# Altium project manipulator1.PrjPcb
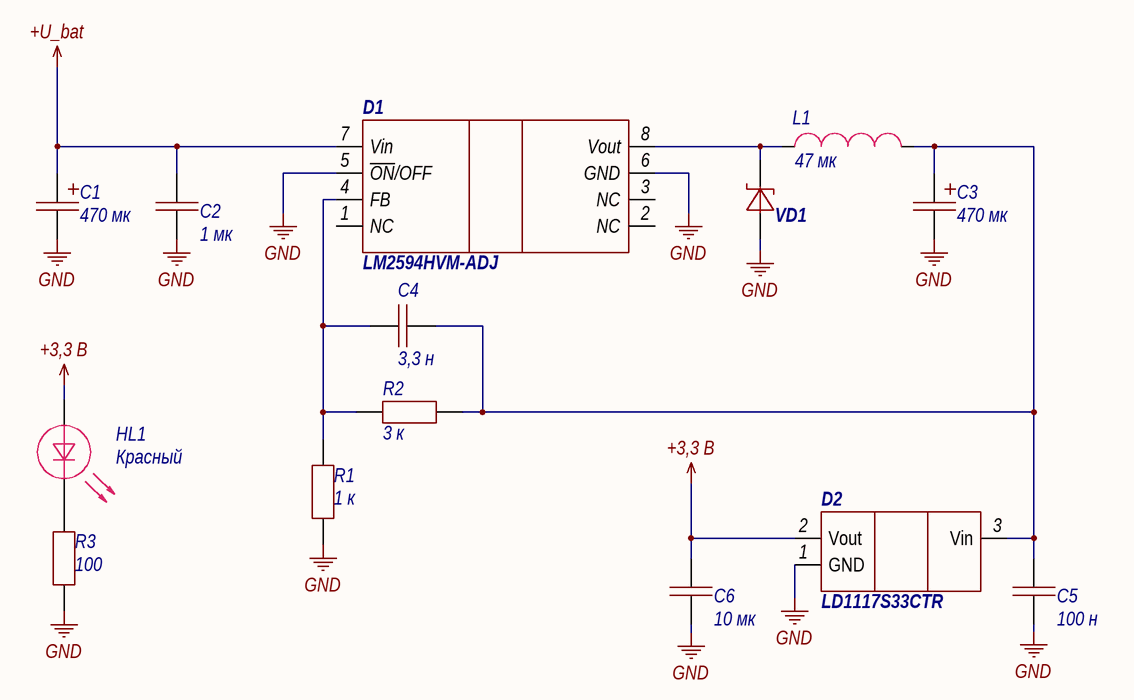
[diagram p0: Power 3.3V to mc.SchDoc]
3 sheets, 44 parts. Net scope: flat (ports and power ports of the same name join across sheets).
Board files: PCBtest.PcbDoc, PCBtest2.PcbDoc
Sheets:
  Power 3.3V to mc.SchDoc
  Power 12V to servo.SchDoc
  MC_stm32.SchDoc

## Sheet Power 3.3V to mc.SchDoc
size A4; SheetNumber: 1; SheetTotal: 3

### Parts
C1  value 470 мк  [RADIAL-2 8mm]  (hidden comment: Конденсатор полевой)
C2  value 1 мк  [0603C]  (hidden comment: Конденсатор)
C3  value 470 мк  [RADIAL-2 10MM]  (hidden comment: Конденсатор полевой)
C4  value 3,3 н  [0603C]  (hidden comment: Конденсатор)
C5  value 100 н  [0603C]  (hidden comment: Конденсатор)
C6  value 10 мк  [0603C]  (hidden comment: Конденсатор)
D1  LM2594HVM-ADJ  [SOIC_8N]
D2  LD1117S33CTR  [SOT223]
HL1  Color: Красный  [0805D]
L1  value 47 мк  [IND_B82477G]  (hidden comment: Inductance)
R1  value 1 к  [0603R]  (hidden comment: Resistor)
R2  value 3 к  [0603R]  (hidden comment: Resistor)
R3  value 100  [0603R]  (hidden comment: Resistor)
VD1  Диод Шоттки  [SMC]  (value not drawn)

### Nets
+3,3 В: C6.2 D2.2(Vout) HL1.1
+U_bat: C1.1 C2.2 D1.7(Vin)
GND: C1.2 C2.1 C3.2 C5.1 C6.1 D1.5(~{ON}/OFF) D1.6(GND) D2.1(GND) R1.2 R3.1 VD1.1
NetC3_1: C3.1 C4.2 C5.2 D2.3(Vin) L1.2 R2.2
NetC4_1: C4.1 D1.4(FB) R1.1 R2.1
NetD1_8: D1.8(Vout) L1.1 VD1.2
NetHL1_2: HL1.2 R3.2

Not connected (* = marked no-connect by the designer): D1 1(NC) 2(NC) 3(NC)

### Library data of the parts
C1 = Capacitor_pol: Конденсатор электролит. 470 мкФ, 50 В, 8 мм
C2 = Capacitor: Конденсатор керамический SMD, 0603, 1 мкФ
C3 = Capacitor_pol: Конденсатор электролит. 35В, 470мкФ, 10x16
C4 = Capacitor: Конденсатор керамический SMD, 0603
C5 = Capacitor: Конденсатор керамический SMD, 0603, 0.1 uF
C6 = Capacitor: Конденсатор керамический smd 10 мкФ, 0603,
D1 = LM2594HVM-ADJ: Импульсный DC-DC преобразователь, вход до 60 вольт, регулируемый выход, выходной ток 2 Ампера
D2 = LD1117S33CTR: Линейный стабилизатор напряжения 3,3 вольта. Максимальный ток - 0,8 ампер, гарантированное падение напряжения 1,3 вольта
HL1 = LED: Светодиод SMD 0805, 30 мА, 2.1 В; Manufacturer: -; Rate: -; Datasheet: -; Shop: -; Notice: -; Case: -
L1 = Inductance: Катушка индуктивности SMD, 47 мкГн, 2.5 А, 12.8х12.8, B82477G4473M,
R1 = Resistor: 0.1Вт 0603 1 кОм, 1%. Чип резистор (SMD); Power: *
R2 = Resistor: 0.1Вт 0603 1 кОм, 1%, Чип резистор (SMD); Power: *
R3 = Resistor: Резистор SMD, 43 Ом; Power: *
VD1 = Schottky diode: Диод Шоттки 30 В 3 А, SMD, SMC, SK33; Value: {Номинал}

## Sheet Power 12V to servo.SchDoc
size A4; SheetNumber: 2; SheetTotal: 3
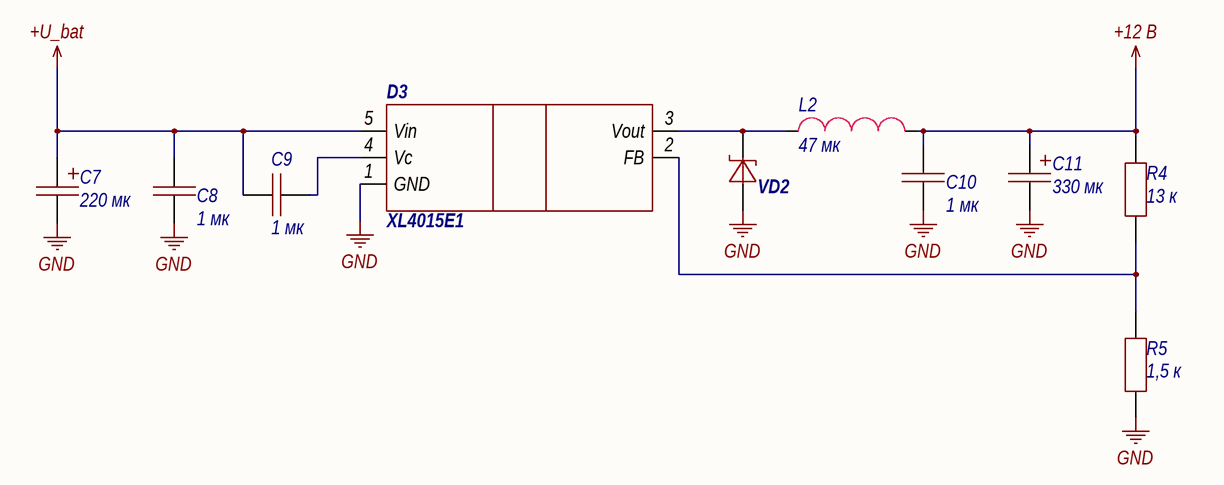
[diagram p1: Power 12V to servo.SchDoc]

### Parts
C7  value 220 мк  [RADIAL-2 10MM]  (hidden comment: Конденсатор полевой)
C8  value 1 мк  [0603C]  (hidden comment: Конденсатор)
C9  value 1 мк  [0603C]  (hidden comment: Конденсатор)
C10  value 1 мк  [0603C]  (hidden comment: Конденсатор)
C11  value 330 мк  [RADIAL-2 10MM]  (hidden comment: Конденсатор полевой)
D3  XL4015E1  [TO-263-5]
L2  value 47 мк  [IHLP-6767]  (hidden comment: Inductance)
R4  value 13 к  [0603R]  (hidden comment: Resistor)
R5  value 1,5 к  [0603R]  (hidden comment: Resistor)
VD2  Диод Шоттки  [SMC]  (value not drawn)

### Nets
+12 В: C10.1 C11.1 L2.2 R4.2
+U_bat: C7.1 C8.2 C9.2 D3.5(Vin)
GND: C7.2 C8.1 C10.2 C11.2 D3.1(GND) R5.1 VD2.1
NetC9_1: C9.1 D3.4(Vc)
NetD3_2: D3.2(FB) R4.1 R5.2
NetD3_3: D3.3(Vout) L2.1 VD2.2

### Library data of the parts
C7 = Capacitor_pol: Конденсатор электролит. 220 мкФ, 50 В, 10мм
C8-C10 = Capacitor: Конденсатор керамический SMD, 1 мкФ, 0603
C11 = Capacitor_pol: Конденсатор электролит. 330 мкФ, 25 В, 10 мм
D3 = XL4015E1: Импульсный DC-DC преобразователь. Вход до 36 В. Регулируемый выход. Выходной ток до 5А.
L2 = Inductance: Индуктивность экранированная 47 мкГн, 20%, 8.7 А, 42.7 мОм, IHLP6767GZER470M11
R4 = Resistor: Резистор SMD, 0603, 13 кОм; Power: *
R5 = Resistor: Резистор SMD 0603, 1.5 кОм; Power: *
VD2 = Schottky diode: Диод Шоттки 40 В, 5 А, SMC, B540C-13-F; Value: {Номинал}

## Sheet MC_stm32.SchDoc
size 420 x 297 mm; SheetNumber: 3; SheetTotal: 3
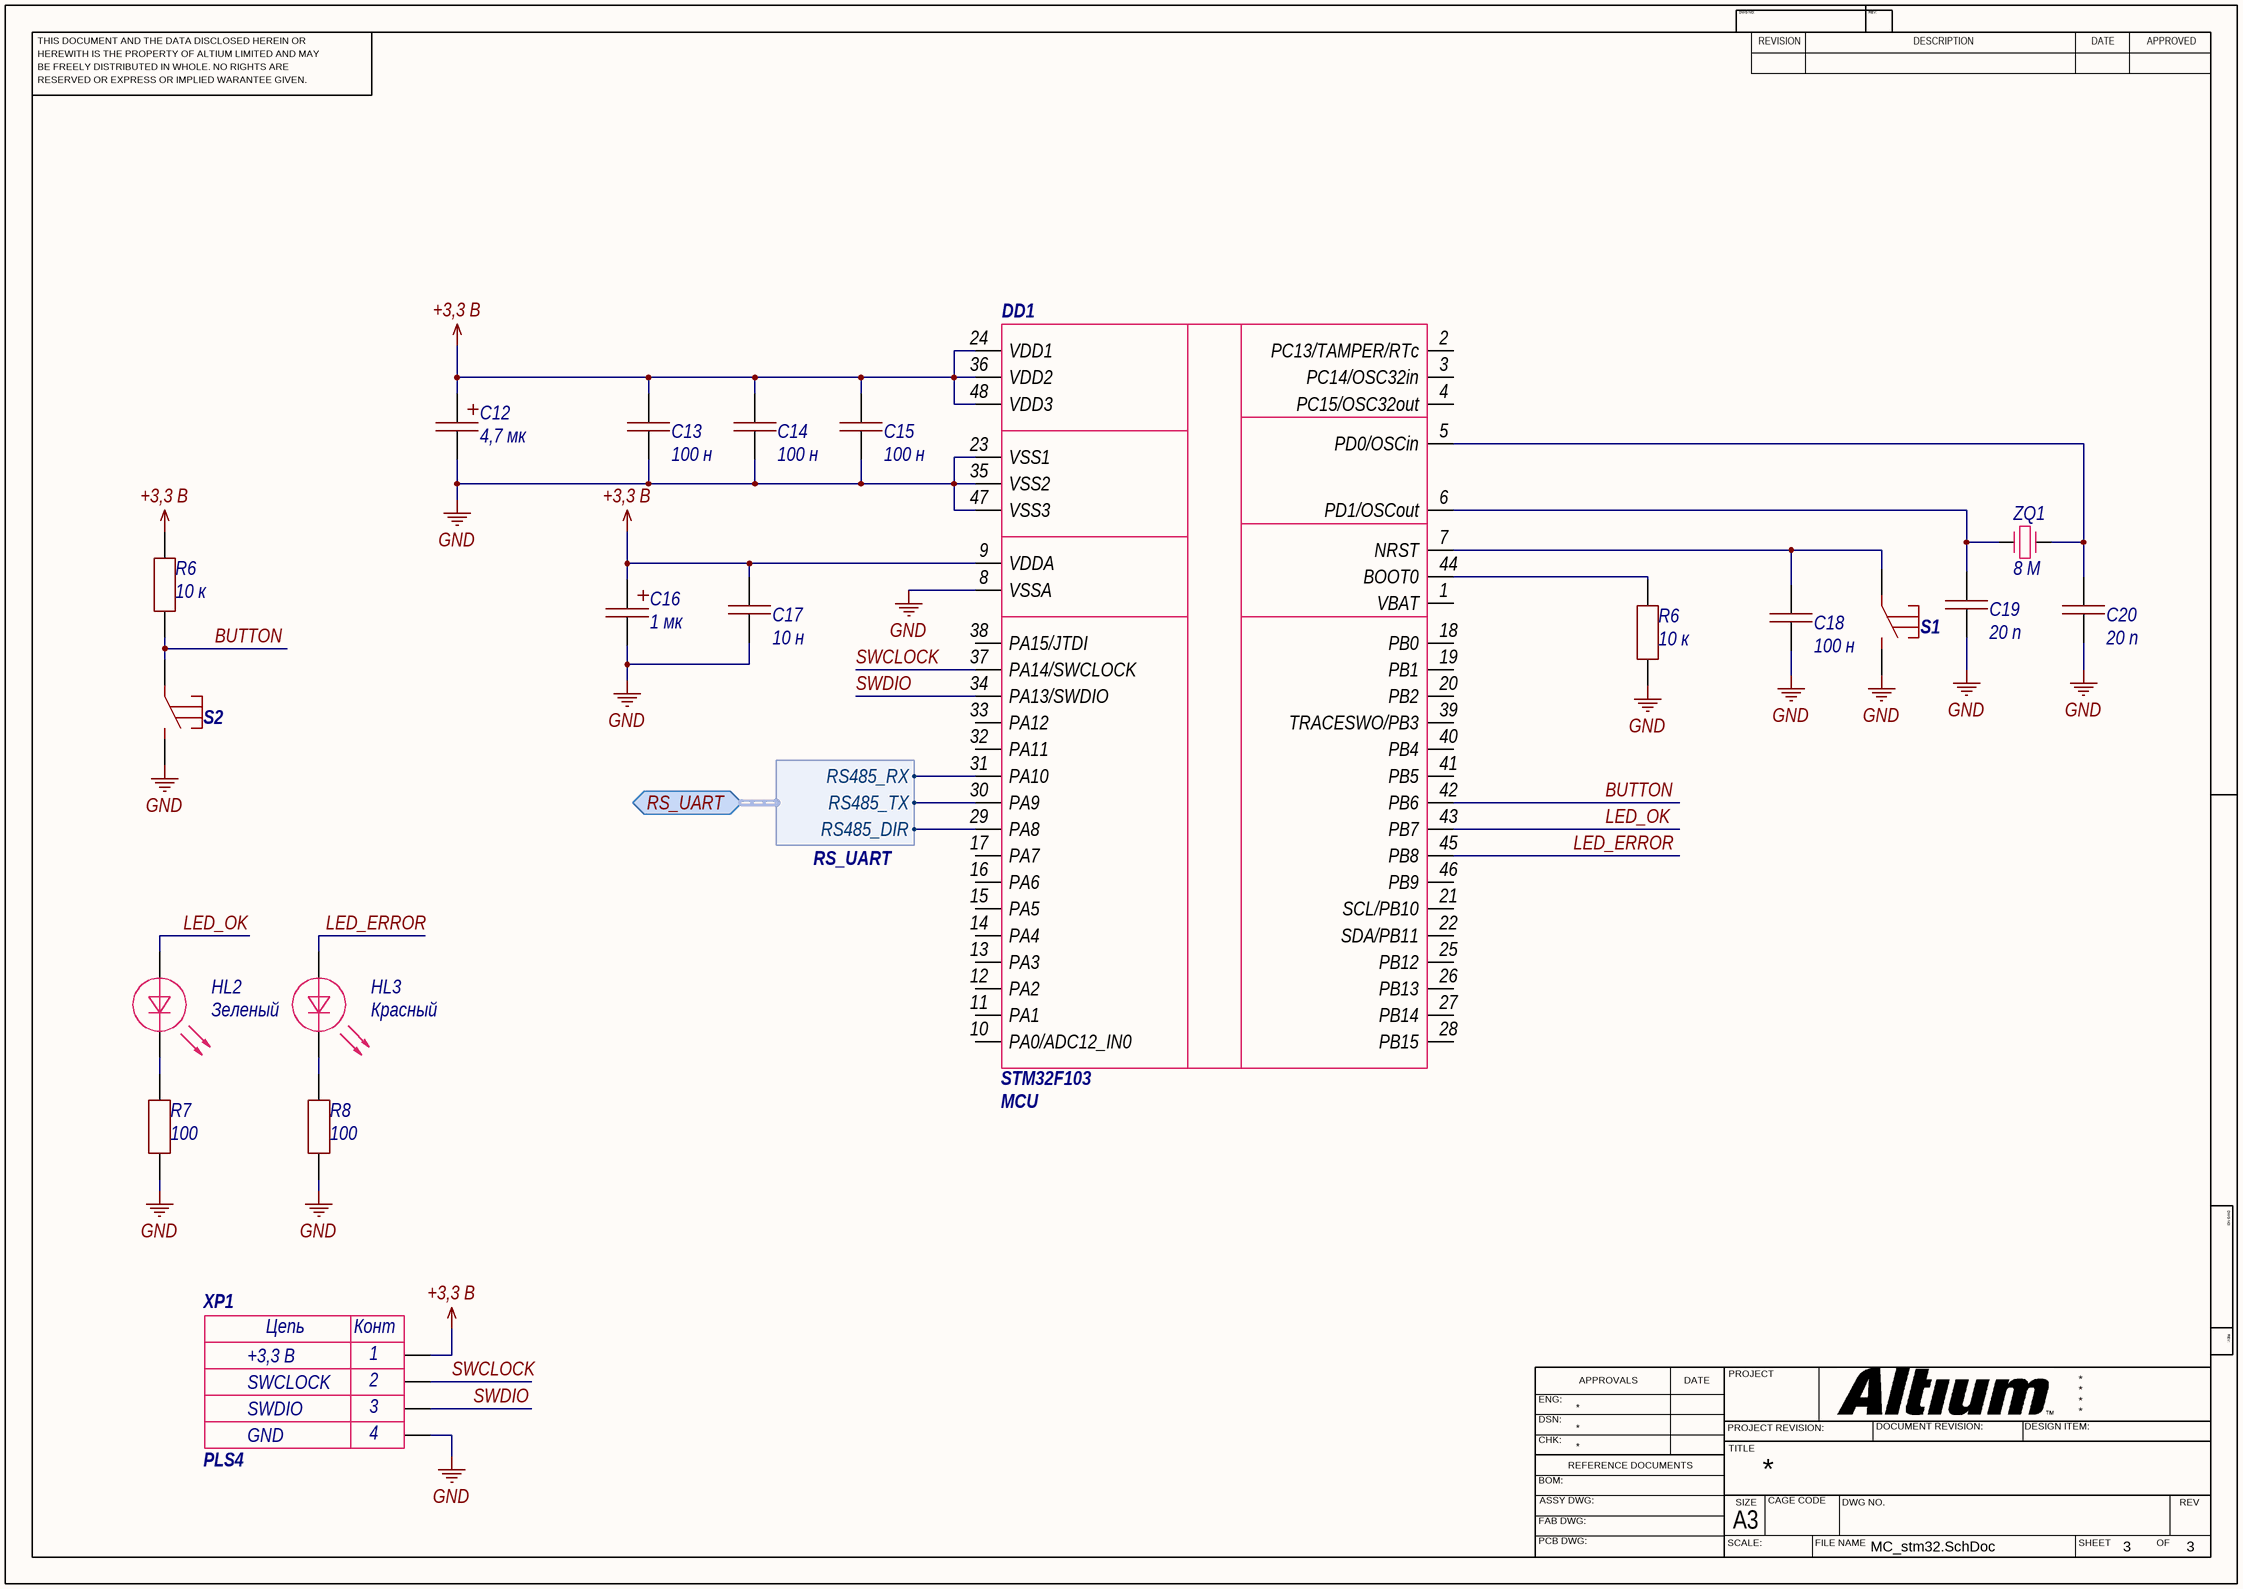
[diagram p2: MC_stm32.SchDoc]

### Parts
(Parts that share a designator on the sheet are numbered #1, #2 ... from top to bottom, then left to right.)
C13  value 100 н  [0603C]  (hidden comment: Конденсатор)
C14  value 100 н  [0603C]  (hidden comment: Конденсатор)
C15  value 100 н  [0603C]  (hidden comment: Конденсатор)
C16  value 1 мк  [TC_A (3216)]  (hidden comment: Конденсатор полевой)
C17  value 10 н  [0603C]  (hidden comment: Конденсатор)
C19  value 20 п  [0603C]  (hidden comment: Конденсатор)
C20  value 20 п  [0603C]  (hidden comment: Конденсатор)
DD1  STM32F103  Value1: MCU  [LQFP48]
HL2  Color: Зеленый  [0805D]
HL3  Color: Красный  [0805D]
R6#1  value 10 к  [0603R]  (hidden comment: Resistor)
R6#2  value 10 к  [0603R]  (hidden comment: Resistor)
R7  value 100  [0603R]  (hidden comment: Resistor)
R8  value 100  [0603R]  (hidden comment: Resistor)
S1  Tact button  [BUTTON_6x6]  (value not drawn)
S2  Tact button  [BUTTON_6x6]  (value not drawn)
XP1  Value3: SWDIO  Value2: SWCLOCK  Value4: GND  Value1: +3,3 В  [PLS4]  (hidden comment: PLS4)
ZQ1  value 8 М  [HC49SD]  (hidden comment: Кварцевый резонатор)
С12  value 4,7 мк  [TC_A (3216)]  (hidden comment: Конденсатор полевой)
С18  value 100 н  [0603C]  (hidden comment: Конденсатор)

### Ports
RS_UART (bidir, harness RS_UART)

### Harnesses
RS_UART: RS485_TX, RS485_DIR, RS485_RX

### Nets
+3,3 В: C13.1 C14.1 C15.1 C16.1 C17.2 DD1.9(VDDA) DD1.24(VDD1) DD1.36(VDD2) DD1.48(VDD3) R6#1.2 XP1.1 С12.1
GND: C13.2 C14.2 C15.2 C16.2 C17.1 C19.2 C20.2 DD1.8(VSSA) DD1.23(VSS1) DD1.35(VSS2) DD1.47(VSS3) R6#2.1 R7.2 R8.1 S1.2 S2.2 XP1.4 С12.2 С18.1
BUTTON: DD1.42(PB6) R6#1.1 S2.1
LED_ERROR: DD1.45(PB8) HL3.1
LED_OK: DD1.43(PB7) HL2.1
SWCLOCK: DD1.37(PA14/SWCLOCK) XP1.2
SWDIO: DD1.34(PA13/SWDIO) XP1.3
NetC19_1: C19.1 DD1.6(PD1/OSCout) ZQ1.1
NetC20_1: C20.1 DD1.5(PD0/OSCin) ZQ1.2
NetDD1_7: DD1.7(NRST) S1.1 С18.2
NetDD1_29: DD1.29(PA8) ; port RS_UART.RS485_DIR
NetDD1_30: DD1.30(PA9) ; port RS_UART.RS485_TX
NetDD1_31: DD1.31(PA10) ; port RS_UART.RS485_RX
NetDD1_44: DD1.44(BOOT0) R6#2.2
NetHL2_2: HL2.2 R7.1
NetHL3_2: HL3.2 R8.2

Not connected (* = marked no-connect by the designer): DD1 1(VBAT) 2(PC13/TAMPER/RTc) 3(PC14/OSC32in) 4(PC15/OSC32out) 10(PA0/ADC12_IN0) 11(PA1) 12(PA2) 13(PA3) 14(PA4) 15(PA5) 16(PA6) 17(PA7) 18(PB0) 19(PB1) 20(PB2) 21(SCL/PB10) 22(SDA/PB11) 25(PB12) 26(PB13) 27(PB14) 28(PB15) 32(PA11) 33(PA12) 38(PA15/JTDI) 39(TRACESWO/PB3) 40(PB4) 41(PB5) 46(PB9)

### Notes on the sheet
- THIS DOCUMENT AND THE DATA DISCLOSED HEREIN OR
- HEREWITH IS THE PROPERTY OF ALTIUM LIMITED AND MAY
- DWG NO:
- REVISION
- REV:
- DESCRIPTION
- DATE
- APPROVED
- BE FREELY DISTRIBUTED IN WHOLE. NO RIGHTS ARE
- RESERVED OR EXPRESS OR IMPLIED WARANTEE GIVEN.
- ENG:
- APPROVALS
- PROJECT
- DSN:
- CHK:
- REFERENCE DOCUMENTS
- PROJECT REVISION:
- TITLE
- DOCUMENT REVISION:
- DESIGN ITEM:
- BOM:
- FAB DWG:
- PCB DWG:
- ASSY DWG:
- SCALE:
- A3
- SIZE
- CAGE CODE
- FILE NAME
- DWG NO.
- SHEET
- OF
- REV
- (in symbol PLS4) Цепь; Конт

### Library data of the parts
C13-C15 = Capacitor: Конденсатор керамический SMD, 0603, 100 нФ
C16 = Capacitor_pol: Конденсатор электролит. танталовый, 1 мкФ, 3216
C17 = Capacitor: Конденсатор керамический SMD, 0603, 10 нФ
C19 C20 = Capacitor: Конденсатор керамический SMD, 30 пФ, 0603
DD1 = STM32F103_48pin: Микроконтроллер; Manufacturer: ST Microelectronics; Rate: -0,3...4,0В; Shop: магазин с самой дешевой ценой; Notice: 48 пиновая версия STM32F103; Datasheet: http://www.st.com/content/ccc/resource/technical/document/datasheet/33/d4/6f/1d/df/0b/4c/6d/CD00161566.pdf/files/CD00161566.pdf/jcr:content/translations/en.CD00161566.pdf; Case: корпус
HL2 HL3 = LED: Светодиод зеленый SMD 0805; Manufacturer: -; Rate: -; Datasheet: -; Shop: -; Notice: -; Case: -
R6#1 = Resistor: 0603 10 кОм, 1%, Чип резистор (SMD); Power: *
R6#2 = Resistor: 0603 100 кОм, 1%, Чип резистор (SMD); Power: *
R7 R8 = Resistor: 0.1Вт 0603 100 Ом, 1%, Чип резистор (SMD); Power: *
XP1 = PLS4: Manufacturer: Connfly; Notice: Вилка штырьевая 4 пина, шаг 2,54мм; Rate: 500В AC 1min; Datasheet: https://lib.chipdip.ru/227/DOC000227157.pdf; Shop: https://www.chipdip.ru/product/pls-4; Value: PLS4
ZQ1 = XTAL: 8.000 МГц HC-49SM, Кварцевый резонатор
С12 = Capacitor_pol: Конденсатор электролит. танталовый, 4,7 мкФ, 3216
С18 = Capacitor: as C5 on sheet Power 3.3V to mc

## Nets that join several sheets
+3,3 В: Power 3.3V to mc (C6.2 D2.2 HL1.1), MC_stm32 (12 pins)
+U_bat: Power 3.3V to mc (C1.1 C2.2 D1.7), Power 12V to servo (C7.1 C8.2 C9.2 D3.5)
GND: Power 3.3V to mc (11 pins), Power 12V to servo (7 pins), MC_stm32 (19 pins)